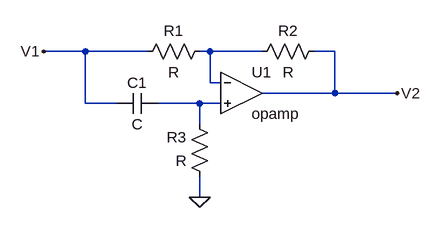
[diagram p0: schematic simulacion_ts1.asc]
simulacion_ts1.asc, the LTspice schematic file:
Version 4
SHEET 1 880 680
WIRE -16 80 -80 80
WIRE 80 80 -16 80
WIRE 176 80 160 80
WIRE 256 80 176 80
WIRE 368 80 336 80
WIRE 176 128 176 80
WIRE 192 128 176 128
WIRE 368 144 368 80
WIRE 368 144 256 144
WIRE 464 144 368 144
WIRE -16 160 -16 80
WIRE 32 160 -16 160
WIRE 160 160 96 160
WIRE 192 160 160 160
WIRE 160 192 160 160
WIRE 160 304 160 272
FLAG 160 304 0
FLAG 464 144 V2
FLAG -80 80 V1
SYMBOL Opamps\\opamp 224 80 R0
SYMATTR InstName U1
SYMBOL res 176 64 R90
WINDOW 0 0 56 VBottom 2
WINDOW 3 32 56 VTop 2
SYMATTR InstName R1
SYMBOL res 352 64 R90
WINDOW 0 0 56 VBottom 2
WINDOW 3 32 56 VTop 2
SYMATTR InstName R2
SYMBOL res 176 288 R180
WINDOW 0 36 76 Left 2
WINDOW 3 36 40 Left 2
SYMATTR InstName R3
SYMBOL cap 96 144 R90
WINDOW 0 0 32 VBottom 2
WINDOW 3 32 32 VTop 2
SYMATTR InstName C1

The netlist it stands for:
* simulacion_ts1.asc
XU1 N001 N002 V2 opamp Aol=100K GBW=10Meg  ; pins invin noninvin out
R1 N001 V1 R
R2 V2 N001 R
R3 0 N002 R
C1 N002 V1 C
.backanno
.end